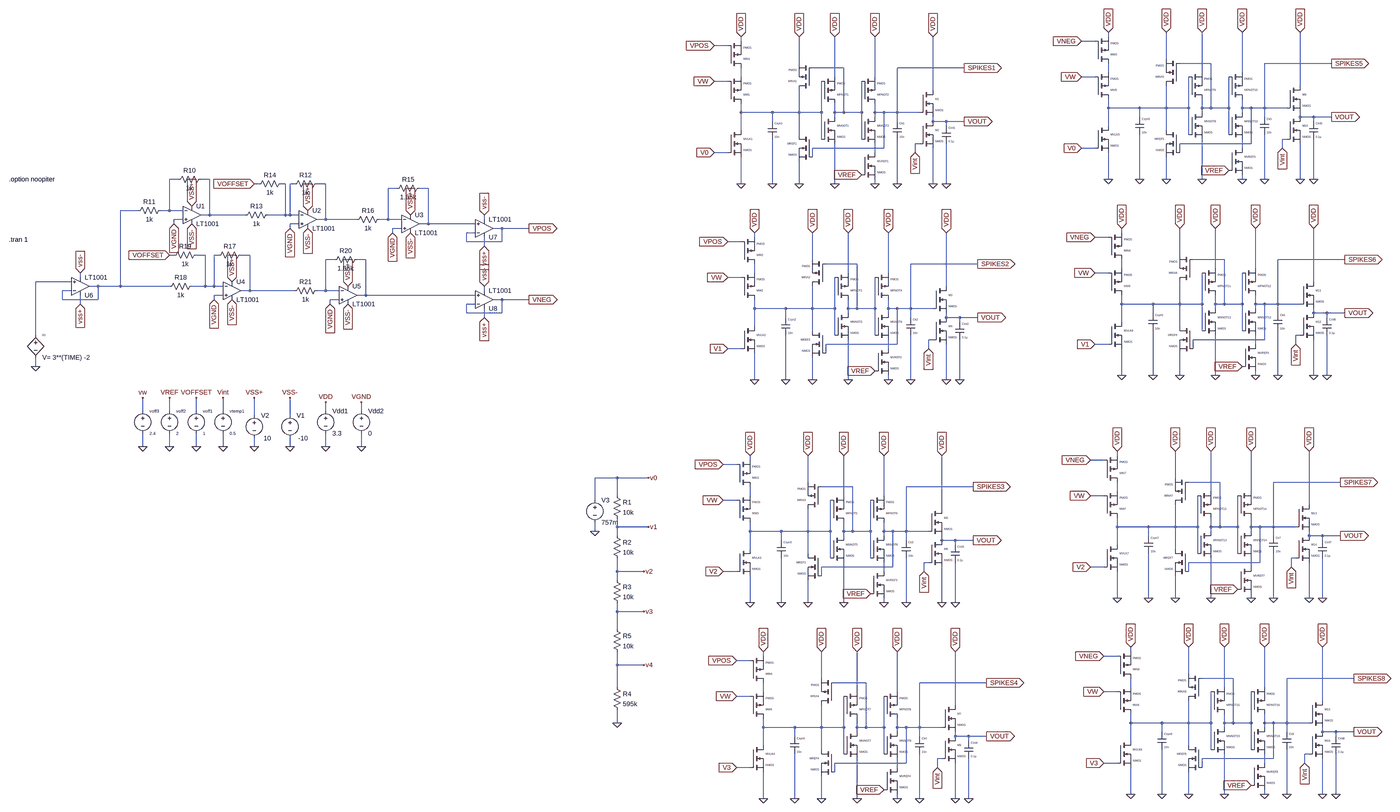
[diagram p0: schematic OZ_8_bounded_curves.asc, whole sheet]
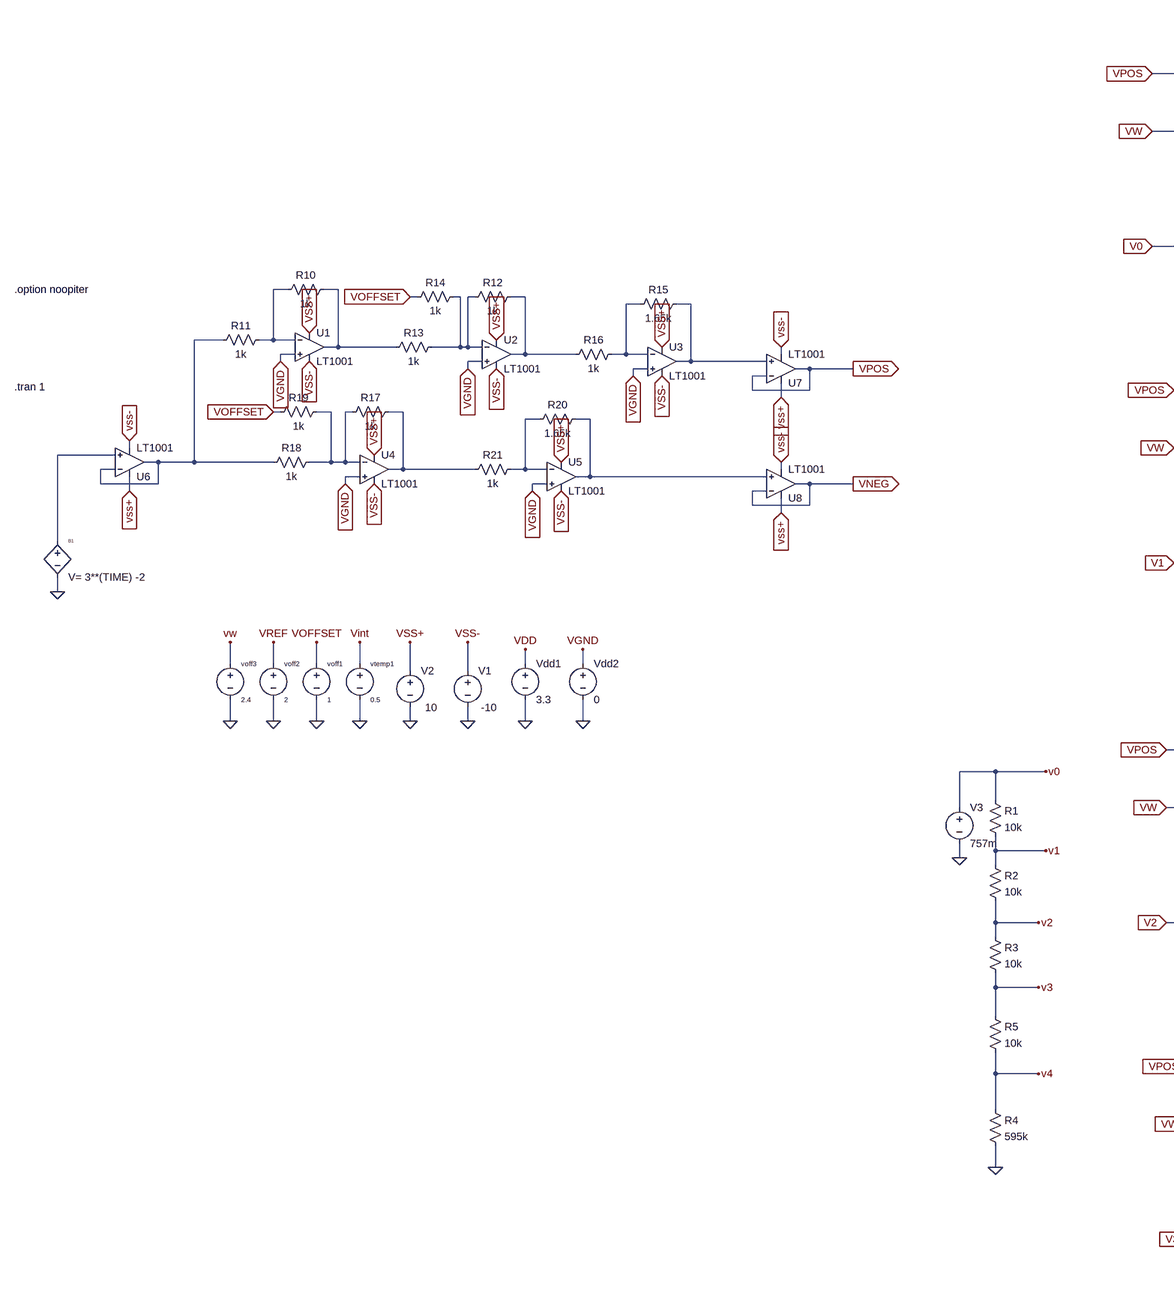
[diagram p1: schematic OZ_8_bounded_curves.asc, part, row 1 of 1, column 1 of 2]
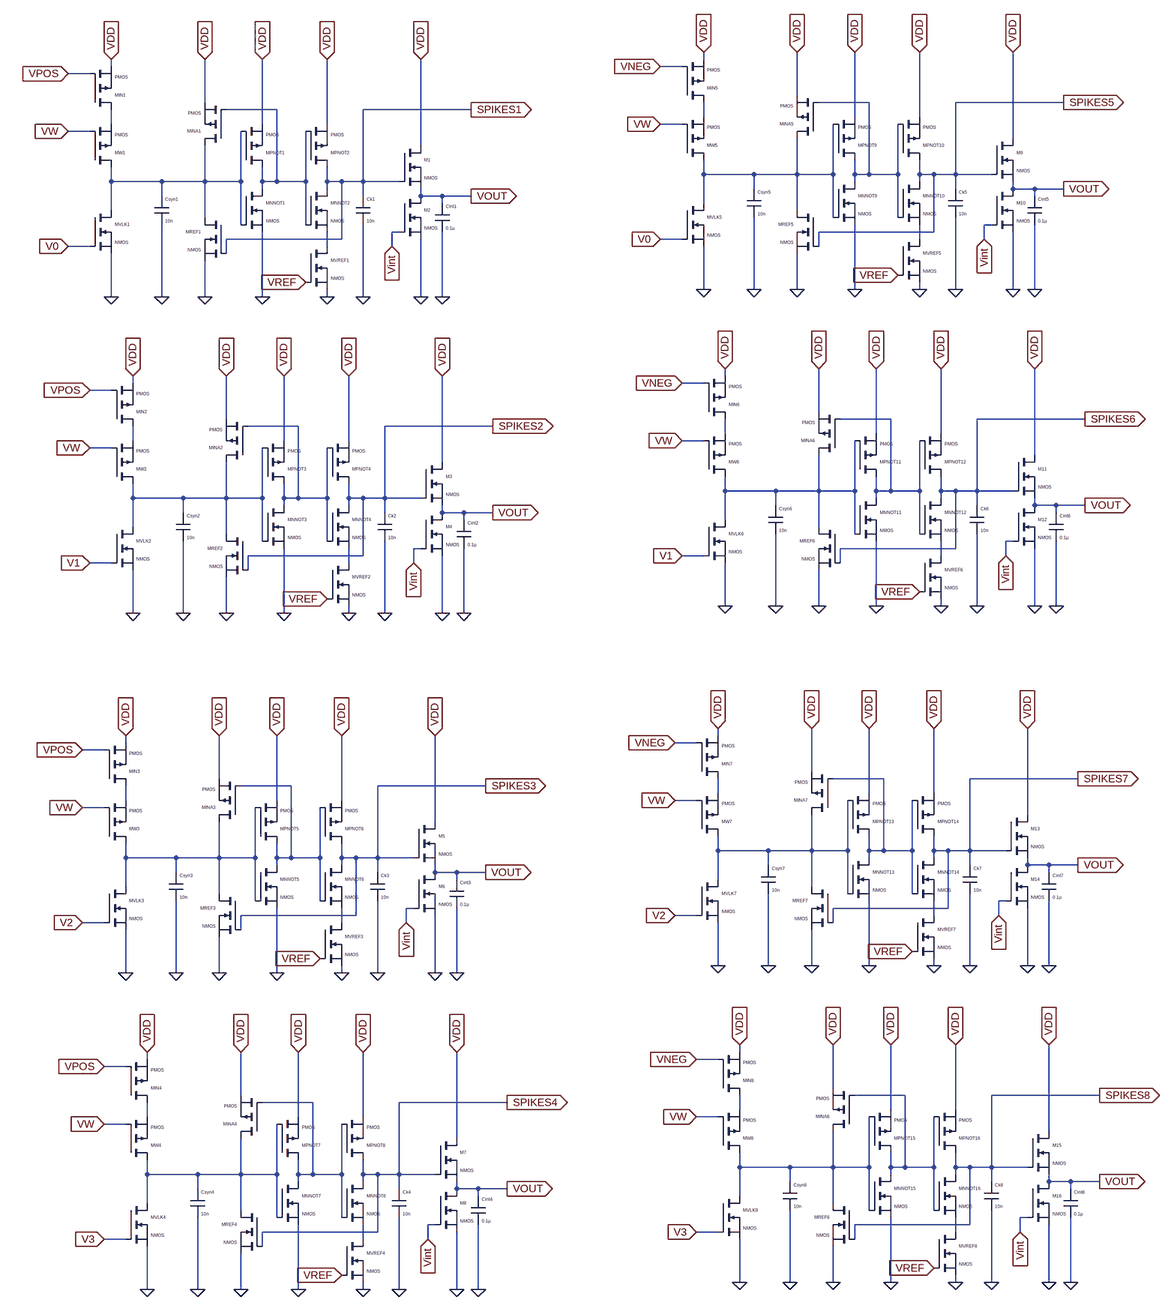
[diagram p2: schematic OZ_8_bounded_curves.asc, part, row 1 of 1, column 2 of 2]
OZ_8_bounded_curves.asc, the LTspice schematic file:
Version 4
SHEET 1 7532 2276
WIRE 5152 -768 5152 -784
WIRE 3760 -752 3760 -768
WIRE 5104 -752 5056 -752
WIRE 3712 -736 3664 -736
WIRE 5360 -688 5360 -784
WIRE 3968 -672 3968 -768
WIRE 5520 -672 5408 -672
WIRE 5952 -672 5712 -672
WIRE 4128 -656 4016 -656
WIRE 4560 -656 4320 -656
WIRE 5152 -640 5152 -672
WIRE 5488 -640 5488 -784
WIRE 5632 -640 5632 -784
WIRE 3760 -624 3760 -656
WIRE 4096 -624 4096 -768
WIRE 4240 -624 4240 -768
WIRE 5104 -624 5056 -624
WIRE 3712 -608 3664 -608
WIRE 5840 -592 5840 -784
WIRE 4448 -576 4448 -768
WIRE 5152 -512 5152 -544
WIRE 5264 -512 5152 -512
WIRE 5360 -512 5360 -592
WIRE 5360 -512 5264 -512
WIRE 5440 -512 5440 -624
WIRE 5440 -512 5360 -512
WIRE 5488 -512 5488 -544
WIRE 5520 -512 5520 -672
WIRE 5520 -512 5488 -512
WIRE 5584 -512 5584 -624
WIRE 5584 -512 5520 -512
WIRE 5632 -512 5632 -544
WIRE 5664 -512 5632 -512
WIRE 5712 -512 5712 -672
WIRE 5712 -512 5664 -512
WIRE 5792 -512 5712 -512
WIRE 3760 -496 3760 -528
WIRE 3872 -496 3760 -496
WIRE 3968 -496 3968 -576
WIRE 3968 -496 3872 -496
WIRE 4048 -496 4048 -608
WIRE 4048 -496 3968 -496
WIRE 4096 -496 4096 -528
WIRE 4128 -496 4128 -656
WIRE 4128 -496 4096 -496
WIRE 4192 -496 4192 -608
WIRE 4192 -496 4128 -496
WIRE 4240 -496 4240 -528
WIRE 4272 -496 4240 -496
WIRE 4320 -496 4320 -656
WIRE 4320 -496 4272 -496
WIRE 4400 -496 4320 -496
WIRE 5488 -496 5488 -512
WIRE 5632 -496 5632 -512
WIRE 4096 -480 4096 -496
WIRE 4240 -480 4240 -496
WIRE 5264 -480 5264 -512
WIRE 5712 -480 5712 -512
WIRE 5840 -480 5840 -496
WIRE 5888 -480 5840 -480
WIRE 5952 -480 5888 -480
WIRE 3872 -464 3872 -496
WIRE 4320 -464 4320 -496
WIRE 4448 -464 4448 -480
WIRE 4496 -464 4448 -464
WIRE 4560 -464 4496 -464
WIRE 5840 -464 5840 -480
WIRE 5888 -464 5888 -480
WIRE 4448 -448 4448 -464
WIRE 4496 -448 4496 -464
WIRE 5152 -448 5152 -512
WIRE 3760 -432 3760 -496
WIRE 5360 -432 5360 -512
WIRE 3968 -416 3968 -496
WIRE 5440 -416 5440 -512
WIRE 5584 -416 5584 -512
WIRE 4048 -400 4048 -496
WIRE 4192 -400 4192 -496
WIRE 5792 -400 5776 -400
WIRE 4400 -384 4384 -384
WIRE 5664 -384 5664 -512
WIRE 5664 -384 5408 -384
WIRE 4272 -368 4272 -496
WIRE 4272 -368 4016 -368
WIRE 5104 -368 5056 -368
WIRE 5632 -368 5632 -400
WIRE 5776 -368 5776 -400
WIRE 3712 -352 3664 -352
WIRE 4240 -352 4240 -384
WIRE 4384 -352 4384 -384
WIRE 5408 -352 5408 -384
WIRE 4016 -336 4016 -368
WIRE 512 -256 480 -256
WIRE 624 -256 592 -256
WIRE 5152 -256 5152 -352
WIRE 5264 -256 5264 -416
WIRE 5360 -256 5360 -336
WIRE 5488 -256 5488 -400
WIRE 5632 -256 5632 -272
WIRE 5712 -256 5712 -416
WIRE 5840 -256 5840 -384
WIRE 5888 -256 5888 -400
WIRE 800 -240 784 -240
WIRE 896 -240 880 -240
WIRE 928 -240 912 -240
WIRE 1040 -240 1008 -240
WIRE 3760 -240 3760 -336
WIRE 3872 -240 3872 -400
WIRE 3968 -240 3968 -320
WIRE 4096 -240 4096 -384
WIRE 4240 -240 4240 -256
WIRE 4320 -240 4320 -400
WIRE 4448 -240 4448 -368
WIRE 4496 -240 4496 -384
WIRE 1296 -224 1264 -224
WIRE 1408 -224 1376 -224
WIRE 368 -144 304 -144
WIRE 480 -144 480 -256
WIRE 480 -144 448 -144
WIRE 528 -144 480 -144
WIRE 624 -128 624 -256
WIRE 624 -128 592 -128
WIRE 752 -128 624 -128
WIRE 896 -128 896 -240
WIRE 896 -128 832 -128
WIRE 912 -128 912 -240
WIRE 912 -128 896 -128
WIRE 944 -128 912 -128
WIRE 528 -112 496 -112
WIRE 1040 -112 1040 -240
WIRE 1040 -112 1008 -112
WIRE 1152 -112 1040 -112
WIRE 1264 -112 1264 -224
WIRE 1264 -112 1232 -112
WIRE 1312 -112 1264 -112
WIRE 1792 -112 1792 -128
WIRE 496 -96 496 -112
WIRE 944 -96 912 -96
WIRE 1408 -96 1408 -224
WIRE 1408 -96 1376 -96
WIRE 1760 -96 1408 -96
WIRE 912 -80 912 -96
WIRE 1312 -80 1280 -80
WIRE 1856 -80 1824 -80
WIRE 1952 -80 1856 -80
WIRE 1280 -64 1280 -80
WIRE 1760 -64 1728 -64
WIRE 5200 -64 5200 -80
WIRE 3808 -48 3808 -64
WIRE 5152 -48 5104 -48
WIRE 1728 -32 1728 -64
WIRE 1856 -32 1856 -80
WIRE 1856 -32 1728 -32
WIRE 3760 -32 3712 -32
WIRE 1792 -16 1792 -48
WIRE 496 16 480 16
WIRE 608 16 576 16
WIRE 656 16 640 16
WIRE 768 16 736 16
WIRE 5408 16 5408 -80
WIRE 1072 32 1040 32
WIRE 1184 32 1152 32
WIRE 4016 32 4016 -64
WIRE 5568 32 5456 32
WIRE 6000 32 5760 32
WIRE 4176 48 4064 48
WIRE 4608 48 4368 48
WIRE 5200 64 5200 32
WIRE 5536 64 5536 -80
WIRE 5680 64 5680 -80
WIRE 3808 80 3808 48
WIRE 4144 80 4144 -64
WIRE 4288 80 4288 -64
WIRE 5152 80 5104 80
WIRE 160 96 160 80
WIRE 3760 96 3712 96
WIRE 128 112 0 112
WIRE 5888 112 5888 -80
WIRE 224 128 192 128
WIRE 304 128 304 -144
WIRE 304 128 224 128
WIRE 480 128 304 128
WIRE 608 128 608 16
WIRE 608 128 560 128
WIRE 640 128 640 16
WIRE 640 128 608 128
WIRE 672 128 640 128
WIRE 4496 128 4496 -64
WIRE 128 144 96 144
WIRE 768 144 768 16
WIRE 768 144 736 144
WIRE 928 144 768 144
WIRE 1040 144 1040 32
WIRE 1040 144 1008 144
WIRE 1088 144 1040 144
WIRE 1792 144 1792 128
WIRE 672 160 640 160
WIRE 1184 160 1184 32
WIRE 1184 160 1152 160
WIRE 1760 160 1184 160
WIRE 96 176 96 144
WIRE 224 176 224 128
WIRE 224 176 96 176
WIRE 640 176 640 160
WIRE 1088 176 1056 176
WIRE 1856 176 1824 176
WIRE 1952 176 1856 176
WIRE 160 192 160 160
WIRE 1056 192 1056 176
WIRE 1760 192 1728 192
WIRE 5200 192 5200 160
WIRE 5312 192 5200 192
WIRE 5408 192 5408 112
WIRE 5408 192 5312 192
WIRE 5488 192 5488 80
WIRE 5488 192 5408 192
WIRE 5536 192 5536 160
WIRE 5568 192 5568 32
WIRE 5568 192 5536 192
WIRE 5632 192 5632 80
WIRE 5632 192 5568 192
WIRE 5680 192 5680 160
WIRE 5712 192 5680 192
WIRE 5760 192 5760 32
WIRE 5760 192 5712 192
WIRE 5840 192 5760 192
WIRE 3808 208 3808 176
WIRE 3920 208 3808 208
WIRE 4016 208 4016 128
WIRE 4016 208 3920 208
WIRE 4096 208 4096 96
WIRE 4096 208 4016 208
WIRE 4144 208 4144 176
WIRE 4176 208 4176 48
WIRE 4176 208 4144 208
WIRE 4240 208 4240 96
WIRE 4240 208 4176 208
WIRE 4288 208 4288 176
WIRE 4320 208 4288 208
WIRE 4368 208 4368 48
WIRE 4368 208 4320 208
WIRE 4448 208 4368 208
WIRE 5536 208 5536 192
WIRE 5680 208 5680 192
WIRE 1728 224 1728 192
WIRE 1856 224 1856 176
WIRE 1856 224 1728 224
WIRE 4144 224 4144 208
WIRE 4288 224 4288 208
WIRE 5312 224 5312 192
WIRE 5760 224 5760 192
WIRE 5888 224 5888 208
WIRE 5936 224 5888 224
WIRE 6000 224 5936 224
WIRE 1792 240 1792 208
WIRE 3920 240 3920 208
WIRE 4368 240 4368 208
WIRE 4496 240 4496 224
WIRE 4544 240 4496 240
WIRE 4608 240 4544 240
WIRE 5888 240 5888 224
WIRE 5936 240 5936 224
WIRE 4496 256 4496 240
WIRE 4544 256 4544 240
WIRE 5200 256 5200 192
WIRE 3808 272 3808 208
WIRE 5408 272 5408 192
WIRE 4016 288 4016 208
WIRE 5488 288 5488 192
WIRE 5632 288 5632 192
WIRE 0 304 0 112
WIRE 4096 304 4096 208
WIRE 4240 304 4240 208
WIRE 5840 304 5824 304
WIRE 4448 320 4432 320
WIRE 5712 320 5712 192
WIRE 5712 320 5456 320
WIRE 4320 336 4320 208
WIRE 4320 336 4064 336
WIRE 5152 336 5104 336
WIRE 5680 336 5680 304
WIRE 5824 336 5824 304
WIRE 3760 352 3712 352
WIRE 4288 352 4288 320
WIRE 4432 352 4432 320
WIRE 5456 352 5456 320
WIRE 4064 368 4064 336
WIRE 0 416 0 384
WIRE 5200 448 5200 352
WIRE 5312 448 5312 288
WIRE 5408 448 5408 368
WIRE 5536 448 5536 304
WIRE 5680 448 5680 432
WIRE 5760 448 5760 288
WIRE 5888 448 5888 320
WIRE 5936 448 5936 304
WIRE 3808 464 3808 368
WIRE 3920 464 3920 304
WIRE 4016 464 4016 384
WIRE 4144 464 4144 320
WIRE 4288 464 4288 448
WIRE 4368 464 4368 304
WIRE 4496 464 4496 336
WIRE 4544 464 4544 320
WIRE 384 576 384 528
WIRE 480 576 480 528
WIRE 576 576 576 528
WIRE 672 576 672 528
WIRE 1040 576 1040 544
WIRE 1168 576 1168 544
WIRE 784 592 784 528
WIRE 912 592 912 528
WIRE 384 704 384 656
WIRE 480 704 480 656
WIRE 576 704 576 656
WIRE 672 704 672 656
WIRE 784 704 784 672
WIRE 912 704 912 672
WIRE 1040 704 1040 656
WIRE 1168 704 1168 656
WIRE 5184 736 5184 720
WIRE 3792 752 3792 736
WIRE 5136 752 5088 752
WIRE 3744 768 3696 768
WIRE 2432 816 2352 816
WIRE 2544 816 2432 816
WIRE 5392 816 5392 720
WIRE 4000 832 4000 736
WIRE 5552 832 5440 832
WIRE 5984 832 5744 832
WIRE 4160 848 4048 848
WIRE 4592 848 4352 848
WIRE 5184 864 5184 832
WIRE 5520 864 5520 720
WIRE 5664 864 5664 720
WIRE 2432 880 2432 816
WIRE 3792 880 3792 848
WIRE 4128 880 4128 736
WIRE 4272 880 4272 736
WIRE 5136 880 5088 880
WIRE 2352 896 2352 816
WIRE 3744 896 3696 896
WIRE 5872 912 5872 720
WIRE 4480 928 4480 736
WIRE 2432 992 2432 960
WIRE 2544 992 2432 992
WIRE 5184 992 5184 960
WIRE 5296 992 5184 992
WIRE 5392 992 5392 912
WIRE 5392 992 5296 992
WIRE 5472 992 5472 880
WIRE 5472 992 5392 992
WIRE 5520 992 5520 960
WIRE 5552 992 5552 832
WIRE 5552 992 5520 992
WIRE 5616 992 5616 880
WIRE 5616 992 5552 992
WIRE 5664 992 5664 960
WIRE 5696 992 5664 992
WIRE 5744 992 5744 832
WIRE 5744 992 5696 992
WIRE 5824 992 5744 992
WIRE 2352 1008 2352 976
WIRE 3792 1008 3792 976
WIRE 3904 1008 3792 1008
WIRE 4000 1008 4000 928
WIRE 4000 1008 3904 1008
WIRE 4080 1008 4080 896
WIRE 4080 1008 4000 1008
WIRE 4128 1008 4128 976
WIRE 4160 1008 4160 848
WIRE 4160 1008 4128 1008
WIRE 4224 1008 4224 896
WIRE 4224 1008 4160 1008
WIRE 4272 1008 4272 976
WIRE 4304 1008 4272 1008
WIRE 4352 1008 4352 848
WIRE 4352 1008 4304 1008
WIRE 4432 1008 4352 1008
WIRE 5520 1008 5520 992
WIRE 5664 1008 5664 992
WIRE 2432 1024 2432 992
WIRE 4128 1024 4128 1008
WIRE 4272 1024 4272 1008
WIRE 5296 1024 5296 992
WIRE 5744 1024 5744 992
WIRE 5872 1024 5872 1008
WIRE 5920 1024 5872 1024
WIRE 5984 1024 5920 1024
WIRE 3904 1040 3904 1008
WIRE 4352 1040 4352 1008
WIRE 4480 1040 4480 1024
WIRE 4528 1040 4480 1040
WIRE 4592 1040 4528 1040
WIRE 5872 1040 5872 1024
WIRE 5920 1040 5920 1024
WIRE 4480 1056 4480 1040
WIRE 4528 1056 4528 1040
WIRE 5184 1056 5184 992
WIRE 3792 1072 3792 1008
WIRE 5392 1072 5392 992
WIRE 4000 1088 4000 1008
WIRE 5472 1088 5472 992
WIRE 5616 1088 5616 992
WIRE 4080 1104 4080 1008
WIRE 4224 1104 4224 1008
WIRE 5824 1104 5808 1104
WIRE 4432 1120 4416 1120
WIRE 5696 1120 5696 992
WIRE 5696 1120 5440 1120
WIRE 4304 1136 4304 1008
WIRE 4304 1136 4048 1136
WIRE 5136 1136 5088 1136
WIRE 5664 1136 5664 1104
WIRE 5808 1136 5808 1104
WIRE 2432 1152 2432 1104
WIRE 2528 1152 2432 1152
WIRE 3744 1152 3696 1152
WIRE 4272 1152 4272 1120
WIRE 4416 1152 4416 1120
WIRE 5440 1152 5440 1120
WIRE 4048 1168 4048 1136
WIRE 2432 1184 2432 1152
WIRE 5184 1248 5184 1152
WIRE 5296 1248 5296 1088
WIRE 5392 1248 5392 1168
WIRE 5520 1248 5520 1104
WIRE 5664 1248 5664 1232
WIRE 5744 1248 5744 1088
WIRE 5872 1248 5872 1120
WIRE 5920 1248 5920 1104
WIRE 3792 1264 3792 1168
WIRE 3904 1264 3904 1104
WIRE 4000 1264 4000 1184
WIRE 4128 1264 4128 1120
WIRE 4272 1264 4272 1248
WIRE 4352 1264 4352 1104
WIRE 4480 1264 4480 1136
WIRE 4528 1264 4528 1120
WIRE 2432 1296 2432 1264
WIRE 2528 1296 2432 1296
WIRE 2432 1360 2432 1296
WIRE 5232 1440 5232 1424
WIRE 3840 1456 3840 1440
WIRE 5184 1456 5136 1456
WIRE 3792 1472 3744 1472
WIRE 2432 1488 2432 1440
WIRE 2528 1488 2432 1488
WIRE 5440 1520 5440 1424
WIRE 4048 1536 4048 1440
WIRE 5600 1536 5488 1536
WIRE 6032 1536 5792 1536
WIRE 4208 1552 4096 1552
WIRE 4640 1552 4400 1552
WIRE 2432 1568 2432 1488
WIRE 5232 1568 5232 1536
WIRE 5568 1568 5568 1424
WIRE 5712 1568 5712 1424
WIRE 3840 1584 3840 1552
WIRE 4176 1584 4176 1440
WIRE 4320 1584 4320 1440
WIRE 5184 1584 5136 1584
WIRE 3792 1600 3744 1600
WIRE 5920 1616 5920 1424
WIRE 4528 1632 4528 1440
WIRE 2432 1696 2432 1648
WIRE 5232 1696 5232 1664
WIRE 5344 1696 5232 1696
WIRE 5440 1696 5440 1616
WIRE 5440 1696 5344 1696
WIRE 5520 1696 5520 1584
WIRE 5520 1696 5440 1696
WIRE 5568 1696 5568 1664
WIRE 5600 1696 5600 1536
WIRE 5600 1696 5568 1696
WIRE 5664 1696 5664 1584
WIRE 5664 1696 5600 1696
WIRE 5712 1696 5712 1664
WIRE 5744 1696 5712 1696
WIRE 5792 1696 5792 1536
WIRE 5792 1696 5744 1696
WIRE 5872 1696 5792 1696
WIRE 3840 1712 3840 1680
WIRE 3952 1712 3840 1712
WIRE 4048 1712 4048 1632
WIRE 4048 1712 3952 1712
WIRE 4128 1712 4128 1600
WIRE 4128 1712 4048 1712
WIRE 4176 1712 4176 1680
WIRE 4208 1712 4208 1552
WIRE 4208 1712 4176 1712
WIRE 4272 1712 4272 1600
WIRE 4272 1712 4208 1712
WIRE 4320 1712 4320 1680
WIRE 4352 1712 4320 1712
WIRE 4400 1712 4400 1552
WIRE 4400 1712 4352 1712
WIRE 4480 1712 4400 1712
WIRE 5568 1712 5568 1696
WIRE 5712 1712 5712 1696
WIRE 4176 1728 4176 1712
WIRE 4320 1728 4320 1712
WIRE 5344 1728 5344 1696
WIRE 5792 1728 5792 1696
WIRE 5920 1728 5920 1712
WIRE 5968 1728 5920 1728
WIRE 6032 1728 5968 1728
WIRE 3952 1744 3952 1712
WIRE 4400 1744 4400 1712
WIRE 4528 1744 4528 1728
WIRE 4576 1744 4528 1744
WIRE 4640 1744 4576 1744
WIRE 5920 1744 5920 1728
WIRE 5968 1744 5968 1728
WIRE 4528 1760 4528 1744
WIRE 4576 1760 4576 1744
WIRE 5232 1760 5232 1696
WIRE 3840 1776 3840 1712
WIRE 5440 1776 5440 1696
WIRE 4048 1792 4048 1712
WIRE 5520 1792 5520 1696
WIRE 5664 1792 5664 1696
WIRE 4128 1808 4128 1712
WIRE 4272 1808 4272 1712
WIRE 5872 1808 5856 1808
WIRE 4480 1824 4464 1824
WIRE 5744 1824 5744 1696
WIRE 5744 1824 5488 1824
WIRE 4352 1840 4352 1712
WIRE 4352 1840 4096 1840
WIRE 5184 1840 5136 1840
WIRE 5712 1840 5712 1808
WIRE 5856 1840 5856 1808
WIRE 3792 1856 3744 1856
WIRE 4320 1856 4320 1824
WIRE 4464 1856 4464 1824
WIRE 5488 1856 5488 1824
WIRE 4096 1872 4096 1840
WIRE 5232 1952 5232 1856
WIRE 5344 1952 5344 1792
WIRE 5440 1952 5440 1872
WIRE 5568 1952 5568 1808
WIRE 5712 1952 5712 1936
WIRE 5792 1952 5792 1792
WIRE 5920 1952 5920 1824
WIRE 5968 1952 5968 1808
WIRE 3840 1968 3840 1872
WIRE 3952 1968 3952 1808
WIRE 4048 1968 4048 1888
WIRE 4176 1968 4176 1824
WIRE 4320 1968 4320 1952
WIRE 4400 1968 4400 1808
WIRE 4528 1968 4528 1840
WIRE 4576 1968 4576 1824
FLAG 672 704 0
FLAG 672 528 Vint
FLAG 1040 544 VDD
FLAG 1040 704 0
FLAG 912 704 0
FLAG 912 528 VSS-
FLAG 784 704 0
FLAG 784 528 VSS+
FLAG 576 704 0
FLAG 576 528 VOFFSET
FLAG 480 704 0
FLAG 480 528 VREF
FLAG 384 704 0
FLAG 384 528 vw
FLAG 1168 544 VGND
FLAG 1168 704 0
FLAG 0 416 0
FLAG 1952 -80 VPOS
IOPIN 1952 -80 Out
FLAG 1952 176 VNEG
IOPIN 1952 176 Out
FLAG 1056 192 VGND
IOPIN 1056 192 In
FLAG 640 176 VGND
IOPIN 640 176 In
FLAG 496 -96 VGND
IOPIN 496 -96 In
FLAG 912 -80 VGND
IOPIN 912 -80 In
FLAG 1280 -64 VGND
IOPIN 1280 -64 In
FLAG 1344 -128 VSS+
IOPIN 1344 -128 In
FLAG 976 -144 VSS+
IOPIN 976 -144 In
FLAG 560 -160 VSS+
IOPIN 560 -160 In
FLAG 704 112 VSS+
IOPIN 704 112 In
FLAG 1120 128 VSS+
IOPIN 1120 128 In
FLAG 1344 -64 VSS-
IOPIN 1344 -64 In
FLAG 976 -80 VSS-
IOPIN 976 -80 In
FLAG 560 -96 VSS-
IOPIN 560 -96 In
FLAG 704 176 VSS-
IOPIN 704 176 In
FLAG 1120 192 VSS-
IOPIN 1120 192 In
FLAG 784 -240 VOFFSET
IOPIN 784 -240 In
FLAG 480 16 VOFFSET
IOPIN 480 16 In
FLAG 160 192 vss+
IOPIN 160 192 In
FLAG 160 80 vss-
IOPIN 160 80 In
FLAG 1792 -16 vss+
IOPIN 1792 -16 In
FLAG 1792 -128 vss-
IOPIN 1792 -128 In
FLAG 1792 240 vss+
IOPIN 1792 240 In
FLAG 1792 128 vss-
IOPIN 1792 128 In
FLAG 4096 -768 VDD
IOPIN 4096 -768 In
FLAG 3664 -736 VPOS
IOPIN 3664 -736 In
FLAG 3664 -608 VW
IOPIN 3664 -608 In
FLAG 3664 -352 V0
IOPIN 3664 -352 In
FLAG 4192 -272 VREF
IOPIN 4192 -272 In
FLAG 4384 -352 Vint
IOPIN 4384 -352 In
FLAG 4560 -464 VOUT
IOPIN 4560 -464 Out
FLAG 3760 -240 0
FLAG 3872 -240 0
FLAG 3968 -240 0
FLAG 4096 -240 0
FLAG 4240 -240 0
FLAG 4320 -240 0
FLAG 4448 -240 0
FLAG 4496 -240 0
FLAG 3968 -768 VDD
IOPIN 3968 -768 In
FLAG 3760 -768 VDD
IOPIN 3760 -768 In
FLAG 4448 -768 VDD
IOPIN 4448 -768 In
FLAG 4240 -768 VDD
IOPIN 4240 -768 In
FLAG 4560 -656 SPIKES1
IOPIN 4560 -656 Out
FLAG 4144 -64 VDD
IOPIN 4144 -64 In
FLAG 3712 -32 VPOS
IOPIN 3712 -32 In
FLAG 3712 96 VW
IOPIN 3712 96 In
FLAG 3712 352 V1
IOPIN 3712 352 In
FLAG 4240 432 VREF
IOPIN 4240 432 In
FLAG 4432 352 Vint
IOPIN 4432 352 In
FLAG 4608 240 VOUT
IOPIN 4608 240 Out
FLAG 3808 464 0
FLAG 3920 464 0
FLAG 4016 464 0
FLAG 4144 464 0
FLAG 4288 464 0
FLAG 4368 464 0
FLAG 4496 464 0
FLAG 4544 464 0
FLAG 4016 -64 VDD
IOPIN 4016 -64 In
FLAG 3808 -64 VDD
IOPIN 3808 -64 In
FLAG 4496 -64 VDD
IOPIN 4496 -64 In
FLAG 4288 -64 VDD
IOPIN 4288 -64 In
FLAG 4608 48 SPIKES2
IOPIN 4608 48 Out
FLAG 4128 736 VDD
IOPIN 4128 736 In
FLAG 3696 768 VPOS
IOPIN 3696 768 In
FLAG 3696 896 VW
IOPIN 3696 896 In
FLAG 3696 1152 V2
IOPIN 3696 1152 In
FLAG 4224 1232 VREF
IOPIN 4224 1232 In
FLAG 4416 1152 Vint
IOPIN 4416 1152 In
FLAG 4592 1040 VOUT
IOPIN 4592 1040 Out
FLAG 3792 1264 0
FLAG 3904 1264 0
FLAG 4000 1264 0
FLAG 4128 1264 0
FLAG 4272 1264 0
FLAG 4352 1264 0
FLAG 4480 1264 0
FLAG 4528 1264 0
FLAG 4000 736 VDD
IOPIN 4000 736 In
FLAG 3792 736 VDD
IOPIN 3792 736 In
FLAG 4480 736 VDD
IOPIN 4480 736 In
FLAG 4272 736 VDD
IOPIN 4272 736 In
FLAG 4592 848 SPIKES3
IOPIN 4592 848 Out
FLAG 4176 1440 VDD
IOPIN 4176 1440 In
FLAG 3744 1472 VPOS
IOPIN 3744 1472 In
FLAG 3744 1600 VW
IOPIN 3744 1600 In
FLAG 3744 1856 V3
IOPIN 3744 1856 In
FLAG 4272 1936 VREF
IOPIN 4272 1936 In
FLAG 4464 1856 Vint
IOPIN 4464 1856 In
FLAG 4640 1744 VOUT
IOPIN 4640 1744 Out
FLAG 3840 1968 0
FLAG 3952 1968 0
FLAG 4048 1968 0
FLAG 4176 1968 0
FLAG 4320 1968 0
FLAG 4400 1968 0
FLAG 4528 1968 0
FLAG 4576 1968 0
FLAG 4048 1440 VDD
IOPIN 4048 1440 In
FLAG 3840 1440 VDD
IOPIN 3840 1440 In
FLAG 4528 1440 VDD
IOPIN 4528 1440 In
FLAG 4320 1440 VDD
IOPIN 4320 1440 In
FLAG 4640 1552 SPIKES4
IOPIN 4640 1552 Out
FLAG 5488 -784 VDD
IOPIN 5488 -784 In
FLAG 5056 -752 VNEG
IOPIN 5056 -752 In
FLAG 5056 -624 VW
IOPIN 5056 -624 In
FLAG 5056 -368 V0
IOPIN 5056 -368 In
FLAG 5584 -288 VREF
IOPIN 5584 -288 In
FLAG 5776 -368 Vint
IOPIN 5776 -368 In
FLAG 5952 -480 VOUT
IOPIN 5952 -480 Out
FLAG 5152 -256 0
FLAG 5264 -256 0
FLAG 5360 -256 0
FLAG 5488 -256 0
FLAG 5632 -256 0
FLAG 5712 -256 0
FLAG 5840 -256 0
FLAG 5888 -256 0
FLAG 5360 -784 VDD
IOPIN 5360 -784 In
FLAG 5152 -784 VDD
IOPIN 5152 -784 In
FLAG 5840 -784 VDD
IOPIN 5840 -784 In
FLAG 5632 -784 VDD
IOPIN 5632 -784 In
FLAG 5952 -672 SPIKES5
IOPIN 5952 -672 Out
FLAG 5536 -80 VDD
IOPIN 5536 -80 In
FLAG 5104 -48 VNEG
IOPIN 5104 -48 In
FLAG 5104 80 VW
IOPIN 5104 80 In
FLAG 5104 336 V1
IOPIN 5104 336 In
FLAG 5632 416 VREF
IOPIN 5632 416 In
FLAG 5824 336 Vint
IOPIN 5824 336 In
FLAG 6000 224 VOUT
IOPIN 6000 224 Out
FLAG 5200 448 0
FLAG 5312 448 0
FLAG 5408 448 0
FLAG 5536 448 0
FLAG 5680 448 0
FLAG 5760 448 0
FLAG 5888 448 0
FLAG 5936 448 0
FLAG 5408 -80 VDD
IOPIN 5408 -80 In
FLAG 5200 -80 VDD
IOPIN 5200 -80 In
FLAG 5888 -80 VDD
IOPIN 5888 -80 In
FLAG 5680 -80 VDD
IOPIN 5680 -80 In
FLAG 6000 32 SPIKES6
IOPIN 6000 32 Out
FLAG 5520 720 VDD
IOPIN 5520 720 In
FLAG 5088 752 VNEG
IOPIN 5088 752 In
FLAG 5088 880 VW
IOPIN 5088 880 In
FLAG 5088 1136 V2
IOPIN 5088 1136 In
FLAG 5616 1216 VREF
IOPIN 5616 1216 In
FLAG 5808 1136 Vint
IOPIN 5808 1136 In
FLAG 5984 1024 VOUT
IOPIN 5984 1024 Out
FLAG 5184 1248 0
FLAG 5296 1248 0
FLAG 5392 1248 0
FLAG 5520 1248 0
FLAG 5664 1248 0
FLAG 5744 1248 0
FLAG 5872 1248 0
FLAG 5920 1248 0
FLAG 5392 720 VDD
IOPIN 5392 720 In
FLAG 5184 720 VDD
IOPIN 5184 720 In
FLAG 5872 720 VDD
IOPIN 5872 720 In
FLAG 5664 720 VDD
IOPIN 5664 720 In
FLAG 5984 832 SPIKES7
IOPIN 5984 832 Out
FLAG 5568 1424 VDD
IOPIN 5568 1424 In
FLAG 5136 1456 VNEG
IOPIN 5136 1456 In
FLAG 5136 1584 VW
IOPIN 5136 1584 In
FLAG 5136 1840 V3
IOPIN 5136 1840 In
FLAG 5664 1920 VREF
IOPIN 5664 1920 In
FLAG 5856 1840 Vint
IOPIN 5856 1840 In
FLAG 6032 1728 VOUT
IOPIN 6032 1728 Out
FLAG 5232 1952 0
FLAG 5344 1952 0
FLAG 5440 1952 0
FLAG 5568 1952 0
FLAG 5712 1952 0
FLAG 5792 1952 0
FLAG 5920 1952 0
FLAG 5968 1952 0
FLAG 5440 1424 VDD
IOPIN 5440 1424 In
FLAG 5232 1424 VDD
IOPIN 5232 1424 In
FLAG 5920 1424 VDD
IOPIN 5920 1424 In
FLAG 5712 1424 VDD
IOPIN 5712 1424 In
FLAG 6032 1536 SPIKES8
IOPIN 6032 1536 Out
FLAG 2352 1008 0
FLAG 2544 992 v1
FLAG 2528 1152 v2
FLAG 2528 1296 v3
FLAG 2528 1488 v4
FLAG 2432 1696 0
FLAG 2544 816 v0
SYMBOL voltage 672 560 R0
WINDOW 123 0 0 Left 0
WINDOW 39 0 0 Left 0
WINDOW 0 24 16 Left 1
WINDOW 3 24 96 Left 1
SYMATTR InstName vtemp1
SYMATTR Value 0.5
SYMBOL voltage 1040 560 R0
WINDOW 123 0 0 Left 0
WINDOW 39 0 0 Left 0
SYMATTR InstName Vdd1
SYMATTR Value 3.3
SYMBOL voltage 912 576 R0
WINDOW 3 47 82 Top 2
WINDOW 123 0 0 Left 0
WINDOW 39 0 0 Left 0
SYMATTR Value -10
SYMATTR InstName V1
SYMBOL voltage 784 576 R0
WINDOW 3 47 82 Top 2
WINDOW 123 0 0 Left 0
WINDOW 39 0 0 Left 0
SYMATTR Value 10
SYMATTR InstName V2
SYMBOL voltage 576 560 R0
WINDOW 123 0 0 Left 0
WINDOW 39 0 0 Left 0
WINDOW 0 24 16 Left 1
WINDOW 3 24 96 Left 1
SYMATTR InstName voff1
SYMATTR Value 1
SYMBOL voltage 480 560 R0
WINDOW 123 0 0 Left 0
WINDOW 39 0 0 Left 0
WINDOW 0 24 16 Left 1
WINDOW 3 24 96 Left 1
SYMATTR InstName voff2
SYMATTR Value 2
SYMBOL voltage 384 560 R0
WINDOW 123 0 0 Left 0
WINDOW 39 0 0 Left 0
WINDOW 0 24 16 Left 1
WINDOW 3 24 96 Left 1
SYMATTR InstName voff3
SYMATTR Value 2.4
SYMBOL voltage 1168 560 R0
WINDOW 123 0 0 Left 0
WINDOW 39 0 0 Left 0
SYMATTR InstName Vdd2
SYMATTR Value 0
SYMBOL OpAmps\\LT1001 560 -192 R0
SYMATTR InstName U1
SYMBOL res 608 -272 R90
WINDOW 0 0 56 VBottom 2
WINDOW 3 32 56 VTop 2
SYMATTR InstName R10
SYMATTR Value 1k
SYMBOL res 464 -160 R90
WINDOW 0 0 56 VBottom 2
WINDOW 3 32 56 VTop 2
SYMATTR InstName R11
SYMATTR Value 1k
SYMBOL OpAmps\\LT1001 976 -176 R0
SYMATTR InstName U2
SYMBOL res 1024 -256 R90
WINDOW 0 0 56 VBottom 2
WINDOW 3 32 56 VTop 2
SYMATTR InstName R12
SYMATTR Value 1k
SYMBOL res 848 -144 R90
WINDOW 0 0 56 VBottom 2
WINDOW 3 32 56 VTop 2
SYMATTR InstName R13
SYMATTR Value 1k
SYMBOL res 896 -256 R90
WINDOW 0 0 56 VBottom 2
WINDOW 3 32 56 VTop 2
SYMATTR InstName R14
SYMATTR Value 1k
SYMBOL OpAmps\\LT1001 1344 -160 R0
SYMATTR InstName U3
SYMBOL res 1392 -240 R90
WINDOW 0 0 56 VBottom 2
WINDOW 3 32 56 VTop 2
SYMATTR InstName R15
SYMATTR Value 1.65k
SYMBOL res 1248 -128 R90
WINDOW 0 0 56 VBottom 2
WINDOW 3 32 56 VTop 2
SYMATTR InstName R16
SYMATTR Value 1k
SYMBOL OpAmps\\LT1001 704 80 R0
SYMATTR InstName U4
SYMBOL res 752 0 R90
WINDOW 0 0 56 VBottom 2
WINDOW 3 32 56 VTop 2
SYMATTR InstName R17
SYMATTR Value 1k
SYMBOL res 576 112 R90
WINDOW 0 0 56 VBottom 2
WINDOW 3 32 56 VTop 2
SYMATTR InstName R18
SYMATTR Value 1k
SYMBOL res 592 0 R90
WINDOW 0 0 56 VBottom 2
WINDOW 3 32 56 VTop 2
SYMATTR InstName R19
SYMATTR Value 1k
SYMBOL OpAmps\\LT1001 1120 96 R0
SYMATTR InstName U5
SYMBOL res 1168 16 R90
WINDOW 0 0 56 VBottom 2
WINDOW 3 32 56 VTop 2
SYMATTR InstName R20
SYMATTR Value 1.65k
SYMBOL res 1024 128 R90
WINDOW 0 0 56 VBottom 2
WINDOW 3 32 56 VTop 2
SYMATTR InstName R21
SYMATTR Value 1k
SYMBOL OpAmps\\LT1001 160 192 M180
SYMATTR InstName U6
SYMBOL OpAmps\\LT1001 1792 -16 M180
SYMATTR InstName U7
SYMBOL OpAmps\\LT1001 1792 240 M180
SYMATTR InstName U8
SYMBOL pmos 3712 -528 M180
WINDOW 0 56 32 Left 0
WINDOW 3 56 72 Left 0
SYMATTR InstName MW1
SYMBOL cap 3856 -464 R0
WINDOW 0 24 8 Left 0
WINDOW 3 24 56 Left 0
SYMATTR InstName Csyn1
SYMATTR Value 10n
SYMATTR SpiceLine V=4 Irms=162m Rser=0.395426 Lser=0 mfg="KEMET" pn="C0402C103K7PAC" type="X5R" IC=0
SYMBOL cap 4304 -464 R0
WINDOW 0 24 8 Left 0
WINDOW 3 24 56 Left 0
SYMATTR InstName Ck1
SYMATTR Value 10n
SYMBOL pmos 4048 -528 M180
WINDOW 0 56 32 Left 0
WINDOW 3 56 72 Left 0
SYMATTR InstName MPNOT1
SYMBOL nmos 4048 -480 R0
WINDOW 0 56 32 Left 0
WINDOW 3 56 72 Left 0
SYMATTR InstName MNNOT1
SYMBOL nmos 4192 -352 R0
WINDOW 0 56 32 Left 0
WINDOW 3 56 72 Left 0
SYMATTR InstName MVREF1
SYMBOL nmos 4016 -416 M0
WINDOW 0 56 32 Left 0
WINDOW 3 56 72 Left 0
SYMATTR InstName MREF1
SYMBOL nmos 3712 -432 R0
WINDOW 0 56 32 Left 0
WINDOW 3 56 72 Left 0
SYMATTR InstName MVLK1
SYMBOL pmos 4016 -576 R180
WINDOW 0 56 32 Left 0
WINDOW 3 56 72 Left 0
SYMATTR InstName MINA1
SYMBOL pmos 3712 -656 M180
WINDOW 0 56 32 Left 0
WINDOW 3 56 72 Left 0
SYMATTR InstName MIN1
SYMBOL pmos 4192 -528 M180
WINDOW 0 56 32 Left 0
WINDOW 3 56 72 Left 0
SYMATTR InstName MPNOT2
SYMBOL nmos 4192 -480 R0
WINDOW 0 56 32 Left 0
WINDOW 3 56 72 Left 0
SYMATTR InstName MNNOT2
SYMBOL nmos 4400 -576 R0
WINDOW 0 56 32 Left 0
WINDOW 3 56 72 Left 0
SYMATTR InstName M1
SYMBOL nmos 4400 -464 R0
WINDOW 0 56 32 Left 0
WINDOW 3 56 72 Left 0
SYMATTR InstName M2
SYMBOL cap 4480 -448 R0
WINDOW 0 24 8 Left 0
WINDOW 3 24 56 Left 0
SYMATTR InstName Cint1
SYMATTR Value 0.1µ
SYMBOL pmos 3760 176 M180
WINDOW 0 56 32 Left 0
WINDOW 3 56 72 Left 0
SYMATTR InstName MW2
SYMBOL cap 3904 240 R0
WINDOW 0 24 8 Left 0
WINDOW 3 24 56 Left 0
SYMATTR InstName Csyn2
SYMATTR Value 10n
SYMATTR SpiceLine V=4 Irms=162m Rser=0.395426 Lser=0 mfg="KEMET" pn="C0402C103K7PAC" type="X5R" IC=0
SYMBOL cap 4352 240 R0
WINDOW 0 24 8 Left 0
WINDOW 3 24 56 Left 0
SYMATTR InstName Ck2
SYMATTR Value 10n
SYMBOL pmos 4096 176 M180
WINDOW 0 56 32 Left 0
WINDOW 3 56 72 Left 0
SYMATTR InstName MPNOT3
SYMBOL nmos 4096 224 R0
WINDOW 0 56 32 Left 0
WINDOW 3 56 72 Left 0
SYMATTR InstName MNNOT3
SYMBOL nmos 4240 352 R0
WINDOW 0 56 32 Left 0
WINDOW 3 56 72 Left 0
SYMATTR InstName MVREF2
SYMBOL nmos 4064 288 M0
WINDOW 0 56 32 Left 0
WINDOW 3 56 72 Left 0
SYMATTR InstName MREF2
SYMBOL nmos 3760 272 R0
WINDOW 0 56 32 Left 0
WINDOW 3 56 72 Left 0
SYMATTR InstName MVLK2
SYMBOL pmos 4064 128 R180
WINDOW 0 56 32 Left 0
WINDOW 3 56 72 Left 0
SYMATTR InstName MINA2
SYMBOL pmos 3760 48 M180
WINDOW 0 56 32 Left 0
WINDOW 3 56 72 Left 0
SYMATTR InstName MIN2
SYMBOL pmos 4240 176 M180
WINDOW 0 56 32 Left 0
WINDOW 3 56 72 Left 0
SYMATTR InstName MPNOT4
SYMBOL nmos 4240 224 R0
WINDOW 0 56 32 Left 0
WINDOW 3 56 72 Left 0
SYMATTR InstName MNNOT4
SYMBOL nmos 4448 128 R0
WINDOW 0 56 32 Left 0
WINDOW 3 56 72 Left 0
SYMATTR InstName M3
SYMBOL nmos 4448 240 R0
WINDOW 0 56 32 Left 0
WINDOW 3 56 72 Left 0
SYMATTR InstName M4
SYMBOL cap 4528 256 R0
WINDOW 0 24 8 Left 0
WINDOW 3 24 56 Left 0
SYMATTR InstName Cint2
SYMATTR Value 0.1µ
SYMBOL pmos 3744 976 M180
WINDOW 0 56 32 Left 0
WINDOW 3 56 72 Left 0
SYMATTR InstName MW3
SYMBOL cap 3888 1040 R0
WINDOW 0 24 8 Left 0
WINDOW 3 24 56 Left 0
SYMATTR InstName Csyn3
SYMATTR Value 10n
SYMATTR SpiceLine V=4 Irms=162m Rser=0.395426 Lser=0 mfg="KEMET" pn="C0402C103K7PAC" type="X5R" IC=0
SYMBOL cap 4336 1040 R0
WINDOW 0 24 8 Left 0
WINDOW 3 24 56 Left 0
SYMATTR InstName Ck3
SYMATTR Value 10n
SYMBOL pmos 4080 976 M180
WINDOW 0 56 32 Left 0
WINDOW 3 56 72 Left 0
SYMATTR InstName MPNOT5
SYMBOL nmos 4080 1024 R0
WINDOW 0 56 32 Left 0
WINDOW 3 56 72 Left 0
SYMATTR InstName MNNOT5
SYMBOL nmos 4224 1152 R0
WINDOW 0 56 32 Left 0
WINDOW 3 56 72 Left 0
SYMATTR InstName MVREF3
SYMBOL nmos 4048 1088 M0
WINDOW 0 56 32 Left 0
WINDOW 3 56 72 Left 0
SYMATTR InstName MREF3
SYMBOL nmos 3744 1072 R0
WINDOW 0 56 32 Left 0
WINDOW 3 56 72 Left 0
SYMATTR InstName MVLK3
SYMBOL pmos 4048 928 R180
WINDOW 0 56 32 Left 0
WINDOW 3 56 72 Left 0
SYMATTR InstName MINA3
SYMBOL pmos 3744 848 M180
WINDOW 0 56 32 Left 0
WINDOW 3 56 72 Left 0
SYMATTR InstName MIN3
SYMBOL pmos 4224 976 M180
WINDOW 0 56 32 Left 0
WINDOW 3 56 72 Left 0
SYMATTR InstName MPNOT6
SYMBOL nmos 4224 1024 R0
WINDOW 0 56 32 Left 0
WINDOW 3 56 72 Left 0
SYMATTR InstName MNNOT6
SYMBOL nmos 4432 928 R0
WINDOW 0 56 32 Left 0
WINDOW 3 56 72 Left 0
SYMATTR InstName M5
SYMBOL nmos 4432 1040 R0
WINDOW 0 56 32 Left 0
WINDOW 3 56 72 Left 0
SYMATTR InstName M6
SYMBOL cap 4512 1056 R0
WINDOW 0 24 8 Left 0
WINDOW 3 24 56 Left 0
SYMATTR InstName Cint3
SYMATTR Value 0.1µ
SYMBOL pmos 3792 1680 M180
WINDOW 0 56 32 Left 0
WINDOW 3 56 72 Left 0
SYMATTR InstName MW4
SYMBOL cap 3936 1744 R0
WINDOW 0 24 8 Left 0
WINDOW 3 24 56 Left 0
SYMATTR InstName Csyn4
SYMATTR Value 10n
SYMATTR SpiceLine V=4 Irms=162m Rser=0.395426 Lser=0 mfg="KEMET" pn="C0402C103K7PAC" type="X5R" IC=0
SYMBOL cap 4384 1744 R0
WINDOW 0 24 8 Left 0
WINDOW 3 24 56 Left 0
SYMATTR InstName Ck4
SYMATTR Value 10n
SYMBOL pmos 4128 1680 M180
WINDOW 0 56 32 Left 0
WINDOW 3 56 72 Left 0
SYMATTR InstName MPNOT7
SYMBOL nmos 4128 1728 R0
WINDOW 0 56 32 Left 0
WINDOW 3 56 72 Left 0
SYMATTR InstName MNNOT7
SYMBOL nmos 4272 1856 R0
WINDOW 0 56 32 Left 0
WINDOW 3 56 72 Left 0
SYMATTR InstName MVREF4
SYMBOL nmos 4096 1792 M0
WINDOW 0 56 32 Left 0
WINDOW 3 56 72 Left 0
SYMATTR InstName MREF4
SYMBOL nmos 3792 1776 R0
WINDOW 0 56 32 Left 0
WINDOW 3 56 72 Left 0
SYMATTR InstName MVLK4
SYMBOL pmos 4096 1632 R180
WINDOW 0 56 32 Left 0
WINDOW 3 56 72 Left 0
SYMATTR InstName MINA4
SYMBOL pmos 3792 1552 M180
WINDOW 0 56 32 Left 0
WINDOW 3 56 72 Left 0
SYMATTR InstName MIN4
SYMBOL pmos 4272 1680 M180
WINDOW 0 56 32 Left 0
WINDOW 3 56 72 Left 0
SYMATTR InstName MPNOT8
SYMBOL nmos 4272 1728 R0
WINDOW 0 56 32 Left 0
WINDOW 3 56 72 Left 0
SYMATTR InstName MNNOT8
SYMBOL nmos 4480 1632 R0
WINDOW 0 56 32 Left 0
WINDOW 3 56 72 Left 0
SYMATTR InstName M7
SYMBOL nmos 4480 1744 R0
WINDOW 0 56 32 Left 0
WINDOW 3 56 72 Left 0
SYMATTR InstName M8
SYMBOL cap 4560 1760 R0
WINDOW 0 24 8 Left 0
WINDOW 3 24 56 Left 0
SYMATTR InstName Cint4
SYMATTR Value 0.1µ
SYMBOL pmos 5104 -544 M180
WINDOW 0 56 32 Left 0
WINDOW 3 56 72 Left 0
SYMATTR InstName MW5
SYMBOL cap 5248 -480 R0
WINDOW 0 24 8 Left 0
WINDOW 3 24 56 Left 0
SYMATTR InstName Csyn5
SYMATTR Value 10n
SYMATTR SpiceLine V=4 Irms=162m Rser=0.395426 Lser=0 mfg="KEMET" pn="C0402C103K7PAC" type="X5R" IC=0
SYMBOL cap 5696 -480 R0
WINDOW 0 24 8 Left 0
WINDOW 3 24 56 Left 0
SYMATTR InstName Ck5
SYMATTR Value 10n
SYMBOL pmos 5440 -544 M180
WINDOW 0 56 32 Left 0
WINDOW 3 56 72 Left 0
SYMATTR InstName MPNOT9
SYMBOL nmos 5440 -496 R0
WINDOW 0 56 32 Left 0
WINDOW 3 56 72 Left 0
SYMATTR InstName MNNOT9
SYMBOL nmos 5584 -368 R0
WINDOW 0 56 32 Left 0
WINDOW 3 56 72 Left 0
SYMATTR InstName MVREF5
SYMBOL nmos 5408 -432 M0
WINDOW 0 56 32 Left 0
WINDOW 3 56 72 Left 0
SYMATTR InstName MREF5
SYMBOL nmos 5104 -448 R0
WINDOW 0 56 32 Left 0
WINDOW 3 56 72 Left 0
SYMATTR InstName MVLK5
SYMBOL pmos 5408 -592 R180
WINDOW 0 56 32 Left 0
WINDOW 3 56 72 Left 0
SYMATTR InstName MINA5
SYMBOL pmos 5104 -672 M180
WINDOW 0 56 32 Left 0
WINDOW 3 56 72 Left 0
SYMATTR InstName MIN5
SYMBOL pmos 5584 -544 M180
WINDOW 0 56 32 Left 0
WINDOW 3 56 72 Left 0
SYMATTR InstName MPNOT10
SYMBOL nmos 5584 -496 R0
WINDOW 0 56 32 Left 0
WINDOW 3 56 72 Left 0
SYMATTR InstName MNNOT10
SYMBOL nmos 5792 -592 R0
WINDOW 0 56 32 Left 0
WINDOW 3 56 72 Left 0
SYMATTR InstName M9
SYMBOL nmos 5792 -480 R0
WINDOW 0 56 32 Left 0
WINDOW 3 56 72 Left 0
SYMATTR InstName M10
SYMBOL cap 5872 -464 R0
WINDOW 0 24 8 Left 0
WINDOW 3 24 56 Left 0
SYMATTR InstName Cint5
SYMATTR Value 0.1µ
SYMBOL pmos 5152 160 M180
WINDOW 0 56 32 Left 0
WINDOW 3 56 72 Left 0
SYMATTR InstName MW6
SYMBOL cap 5296 224 R0
WINDOW 0 24 8 Left 0
WINDOW 3 24 56 Left 0
SYMATTR InstName Csyn6
SYMATTR Value 10n
SYMATTR SpiceLine V=4 Irms=162m Rser=0.395426 Lser=0 mfg="KEMET" pn="C0402C103K7PAC" type="X5R" IC=0
SYMBOL cap 5744 224 R0
WINDOW 0 24 8 Left 0
WINDOW 3 24 56 Left 0
SYMATTR InstName Ck6
SYMATTR Value 10n
SYMBOL pmos 5488 160 M180
WINDOW 0 56 32 Left 0
WINDOW 3 56 72 Left 0
SYMATTR InstName MPNOT11
SYMBOL nmos 5488 208 R0
WINDOW 0 56 32 Left 0
WINDOW 3 56 72 Left 0
SYMATTR InstName MNNOT11
SYMBOL nmos 5632 336 R0
WINDOW 0 56 32 Left 0
WINDOW 3 56 72 Left 0
SYMATTR InstName MVREF6
SYMBOL nmos 5456 272 M0
WINDOW 0 56 32 Left 0
WINDOW 3 56 72 Left 0
SYMATTR InstName MREF6
SYMBOL nmos 5152 256 R0
WINDOW 0 56 32 Left 0
WINDOW 3 56 72 Left 0
SYMATTR InstName MVLK6
SYMBOL pmos 5456 112 R180
WINDOW 0 56 32 Left 0
WINDOW 3 56 72 Left 0
SYMATTR InstName MINA6
SYMBOL pmos 5152 32 M180
WINDOW 0 56 32 Left 0
WINDOW 3 56 72 Left 0
SYMATTR InstName MIN6
SYMBOL pmos 5632 160 M180
WINDOW 0 56 32 Left 0
WINDOW 3 56 72 Left 0
SYMATTR InstName MPNOT12
SYMBOL nmos 5632 208 R0
WINDOW 0 56 32 Left 0
WINDOW 3 56 72 Left 0
SYMATTR InstName MNNOT12
SYMBOL nmos 5840 112 R0
WINDOW 0 56 32 Left 0
WINDOW 3 56 72 Left 0
SYMATTR InstName M11
SYMBOL nmos 5840 224 R0
WINDOW 0 56 32 Left 0
WINDOW 3 56 72 Left 0
SYMATTR InstName M12
SYMBOL cap 5920 240 R0
WINDOW 0 24 8 Left 0
WINDOW 3 24 56 Left 0
SYMATTR InstName Cint6
SYMATTR Value 0.1µ
SYMBOL pmos 5136 960 M180
WINDOW 0 56 32 Left 0
WINDOW 3 56 72 Left 0
SYMATTR InstName MW7
SYMBOL cap 5280 1024 R0
WINDOW 0 24 8 Left 0
WINDOW 3 24 56 Left 0
SYMATTR InstName Csyn7
SYMATTR Value 10n
SYMATTR SpiceLine V=4 Irms=162m Rser=0.395426 Lser=0 mfg="KEMET" pn="C0402C103K7PAC" type="X5R" IC=0
SYMBOL cap 5728 1024 R0
WINDOW 0 24 8 Left 0
WINDOW 3 24 56 Left 0
SYMATTR InstName Ck7
SYMATTR Value 10n
SYMBOL pmos 5472 960 M180
WINDOW 0 56 32 Left 0
WINDOW 3 56 72 Left 0
SYMATTR InstName MPNOT13
SYMBOL nmos 5472 1008 R0
WINDOW 0 56 32 Left 0
WINDOW 3 56 72 Left 0
SYMATTR InstName MNNOT13
SYMBOL nmos 5616 1136 R0
WINDOW 0 56 32 Left 0
WINDOW 3 56 72 Left 0
SYMATTR InstName MVREF7
SYMBOL nmos 5440 1072 M0
WINDOW 0 56 32 Left 0
WINDOW 3 56 72 Left 0
SYMATTR InstName MREF7
SYMBOL nmos 5136 1056 R0
WINDOW 0 56 32 Left 0
WINDOW 3 56 72 Left 0
SYMATTR InstName MVLK7
SYMBOL pmos 5440 912 R180
WINDOW 0 56 32 Left 0
WINDOW 3 56 72 Left 0
SYMATTR InstName MINA7
SYMBOL pmos 5136 832 M180
WINDOW 0 56 32 Left 0
WINDOW 3 56 72 Left 0
SYMATTR InstName MIN7
SYMBOL pmos 5616 960 M180
WINDOW 0 56 32 Left 0
WINDOW 3 56 72 Left 0
SYMATTR InstName MPNOT14
SYMBOL nmos 5616 1008 R0
WINDOW 0 56 32 Left 0
WINDOW 3 56 72 Left 0
SYMATTR InstName MNNOT14
SYMBOL nmos 5824 912 R0
WINDOW 0 56 32 Left 0
WINDOW 3 56 72 Left 0
SYMATTR InstName M13
SYMBOL nmos 5824 1024 R0
WINDOW 0 56 32 Left 0
WINDOW 3 56 72 Left 0
SYMATTR InstName M14
SYMBOL cap 5904 1040 R0
WINDOW 0 24 8 Left 0
WINDOW 3 24 56 Left 0
SYMATTR InstName Cint7
SYMATTR Value 0.1µ
SYMBOL pmos 5184 1664 M180
WINDOW 0 56 32 Left 0
WINDOW 3 56 72 Left 0
SYMATTR InstName MW8
SYMBOL cap 5328 1728 R0
WINDOW 0 24 8 Left 0
WINDOW 3 24 56 Left 0
SYMATTR InstName Csyn8
SYMATTR Value 10n
SYMATTR SpiceLine V=4 Irms=162m Rser=0.395426 Lser=0 mfg="KEMET" pn="C0402C103K7PAC" type="X5R" IC=0
SYMBOL cap 5776 1728 R0
WINDOW 0 24 8 Left 0
WINDOW 3 24 56 Left 0
SYMATTR InstName Ck8
SYMATTR Value 10n
SYMBOL pmos 5520 1664 M180
WINDOW 0 56 32 Left 0
WINDOW 3 56 72 Left 0
SYMATTR InstName MPNOT15
SYMBOL nmos 5520 1712 R0
WINDOW 0 56 32 Left 0
WINDOW 3 56 72 Left 0
SYMATTR InstName MNNOT15
SYMBOL nmos 5664 1840 R0
WINDOW 0 56 32 Left 0
WINDOW 3 56 72 Left 0
SYMATTR InstName MVREF8
SYMBOL nmos 5488 1776 M0
WINDOW 0 56 32 Left 0
WINDOW 3 56 72 Left 0
SYMATTR InstName MREF8
SYMBOL nmos 5184 1760 R0
WINDOW 0 56 32 Left 0
WINDOW 3 56 72 Left 0
SYMATTR InstName MVLK8
SYMBOL pmos 5488 1616 R180
WINDOW 0 56 32 Left 0
WINDOW 3 56 72 Left 0
SYMATTR InstName MINA8
SYMBOL pmos 5184 1536 M180
WINDOW 0 56 32 Left 0
WINDOW 3 56 72 Left 0
SYMATTR InstName MIN8
SYMBOL pmos 5664 1664 M180
WINDOW 0 56 32 Left 0
WINDOW 3 56 72 Left 0
SYMATTR InstName MPNOT16
SYMBOL nmos 5664 1712 R0
WINDOW 0 56 32 Left 0
WINDOW 3 56 72 Left 0
SYMATTR InstName MNNOT16
SYMBOL nmos 5872 1616 R0
WINDOW 0 56 32 Left 0
WINDOW 3 56 72 Left 0
SYMATTR InstName M15
SYMBOL nmos 5872 1728 R0
WINDOW 0 56 32 Left 0
WINDOW 3 56 72 Left 0
SYMATTR InstName M16
SYMBOL cap 5952 1744 R0
WINDOW 0 24 8 Left 0
WINDOW 3 24 56 Left 0
SYMATTR InstName Cint8
SYMATTR Value 0.1µ
SYMBOL voltage 2352 880 R0
SYMATTR InstName V3
SYMATTR Value 757m
SYMBOL res 2416 864 R0
SYMATTR InstName R1
SYMATTR Value 10k
SYMBOL res 2416 1008 R0
SYMATTR InstName R2
SYMATTR Value 10k
SYMBOL res 2416 1168 R0
SYMATTR InstName R3
SYMATTR Value 10k
SYMBOL res 2416 1552 R0
SYMATTR InstName R4
SYMATTR Value 595k
SYMBOL res 2416 1344 R0
SYMATTR InstName R5
SYMATTR Value 10k
SYMBOL bv 0 288 R0
WINDOW 0 24 16 Left 0
SYMATTR InstName B1
SYMATTR Value V= 3**(TIME) -2
TEXT -96 -40 Left 2 !.tran 1
TEXT -96 -256 Left 2 !.option noopiter

The netlist it stands for:
* OZ_8_bounded_curves.asc
vtemp1 Vint 0 0.5
Vdd1 VDD 0 3.3
V1 VSS- 0 -10
V2 VSS+ 0 10
voff1 VOFFSET 0 1
voff2 VREF 0 2
voff3 vw 0 2.4
Vdd2 VGND 0 0
XU1 VGND N009 VSS+ VSS- N010 LT1001  ; pins In+ In- V+ V- OUT
R10 N010 N009 1k
R11 N009 N015 1k
XU2 VGND N011 VSS+ VSS- N012 LT1001  ; pins In+ In- V+ V- OUT
R12 N012 N011 1k
R13 N011 N010 1k
R14 N011 VOFFSET 1k
XU3 VGND N013 VSS+ VSS- N014 LT1001  ; pins In+ In- V+ V- OUT
R15 N014 N013 1.65k
R16 N013 N012 1k
XU4 VGND N016 VSS+ VSS- N017 LT1001  ; pins In+ In- V+ V- OUT
R17 N017 N016 1k
R18 N016 N015 1k
R19 N016 VOFFSET 1k
XU5 VGND N018 VSS+ VSS- N019 LT1001  ; pins In+ In- V+ V- OUT
R20 N019 N018 1.65k
R21 N018 N017 1k
XU6 N024 N015 VSS+ VSS- N015 LT1001  ; pins In+ In- V+ V- OUT
XU7 N014 VPOS VSS+ VSS- VPOS LT1001  ; pins In+ In- V+ V- OUT
XU8 N019 VNEG VSS+ VSS- VNEG LT1001  ; pins In+ In- V+ V- OUT
MW1 N006 vw N004 N004 PMOS
Csyn1 N006 0 10n V=4 Irms=162m Rser=0.395426 Lser=0 mfg="KEMET" pn="C0402C103K7PAC" type="X5R" IC=0
Ck1 SPIKES1 0 10n
MPNOT1 N002 N006 VDD VDD PMOS
MNNOT1 N002 N006 0 0 NMOS
MVREF1 N008 VREF 0 0 NMOS
MREF1 N006 SPIKES1 0 0 NMOS
MVLK1 N006 V0 0 0 NMOS
MINA1 N006 N002 VDD VDD PMOS
MIN1 N004 VPOS VDD VDD PMOS
MPNOT2 SPIKES1 N002 VDD VDD PMOS
MNNOT2 SPIKES1 N002 N008 N008 NMOS
M1 VDD SPIKES1 VOUT VOUT NMOS
M2 VOUT Vint 0 0 NMOS
Cint1 VOUT 0 0.1µ
MW2 N026 vw N023 N023 PMOS
Csyn2 N026 0 10n V=4 Irms=162m Rser=0.395426 Lser=0 mfg="KEMET" pn="C0402C103K7PAC" type="X5R" IC=0
Ck2 SPIKES2 0 10n
MPNOT3 N021 N026 VDD VDD PMOS
MNNOT3 N021 N026 0 0 NMOS
MVREF2 N028 VREF 0 0 NMOS
MREF2 N026 SPIKES2 0 0 NMOS
MVLK2 N026 V1 0 0 NMOS
MINA2 N026 N021 VDD VDD PMOS
MIN2 N023 VPOS VDD VDD PMOS
MPNOT4 SPIKES2 N021 VDD VDD PMOS
MNNOT4 SPIKES2 N021 N028 N028 NMOS
M3 VDD SPIKES2 VOUT VOUT NMOS
M4 VOUT Vint 0 0 NMOS
Cint2 VOUT 0 0.1µ
MW3 N034 vw N032 N032 PMOS
Csyn3 N034 0 10n V=4 Irms=162m Rser=0.395426 Lser=0 mfg="KEMET" pn="C0402C103K7PAC" type="X5R" IC=0
Ck3 SPIKES3 0 10n
MPNOT5 N030 N034 VDD VDD PMOS
MNNOT5 N030 N034 0 0 NMOS
MVREF3 N036 VREF 0 0 NMOS
MREF3 N034 SPIKES3 0 0 NMOS
MVLK3 N034 V2 0 0 NMOS
MINA3 N034 N030 VDD VDD PMOS
MIN3 N032 VPOS VDD VDD PMOS
MPNOT6 SPIKES3 N030 VDD VDD PMOS
MNNOT6 SPIKES3 N030 N036 N036 NMOS
M5 VDD SPIKES3 VOUT VOUT NMOS
M6 VOUT Vint 0 0 NMOS
Cint3 VOUT 0 0.1µ
MW4 N042 vw N040 N040 PMOS
Csyn4 N042 0 10n V=4 Irms=162m Rser=0.395426 Lser=0 mfg="KEMET" pn="C0402C103K7PAC" type="X5R" IC=0
Ck4 SPIKES4 0 10n
MPNOT7 N038 N042 VDD VDD PMOS
MNNOT7 N038 N042 0 0 NMOS
MVREF4 N044 VREF 0 0 NMOS
MREF4 N042 SPIKES4 0 0 NMOS
MVLK4 N042 V3 0 0 NMOS
MINA4 N042 N038 VDD VDD PMOS
MIN4 N040 VPOS VDD VDD PMOS
MPNOT8 SPIKES4 N038 VDD VDD PMOS
MNNOT8 SPIKES4 N038 N044 N044 NMOS
M7 VDD SPIKES4 VOUT VOUT NMOS
M8 VOUT Vint 0 0 NMOS
Cint4 VOUT 0 0.1µ
MW5 N005 vw N003 N003 PMOS
Csyn5 N005 0 10n V=4 Irms=162m Rser=0.395426 Lser=0 mfg="KEMET" pn="C0402C103K7PAC" type="X5R" IC=0
Ck5 SPIKES5 0 10n
MPNOT9 N001 N005 VDD VDD PMOS
MNNOT9 N001 N005 0 0 NMOS
MVREF5 N007 VREF 0 0 NMOS
MREF5 N005 SPIKES5 0 0 NMOS
MVLK5 N005 V0 0 0 NMOS
MINA5 N005 N001 VDD VDD PMOS
MIN5 N003 VNEG VDD VDD PMOS
MPNOT10 SPIKES5 N001 VDD VDD PMOS
MNNOT10 SPIKES5 N001 N007 N007 NMOS
M9 VDD SPIKES5 VOUT VOUT NMOS
M10 VOUT Vint 0 0 NMOS
Cint5 VOUT 0 0.1µ
MW6 N025 vw N022 N022 PMOS
Csyn6 N025 0 10n V=4 Irms=162m Rser=0.395426 Lser=0 mfg="KEMET" pn="C0402C103K7PAC" type="X5R" IC=0
Ck6 SPIKES6 0 10n
MPNOT11 N020 N025 VDD VDD PMOS
MNNOT11 N020 N025 0 0 NMOS
MVREF6 N027 VREF 0 0 NMOS
MREF6 N025 SPIKES6 0 0 NMOS
MVLK6 N025 V1 0 0 NMOS
MINA6 N025 N020 VDD VDD PMOS
MIN6 N022 VNEG VDD VDD PMOS
MPNOT12 SPIKES6 N020 VDD VDD PMOS
MNNOT12 SPIKES6 N020 N027 N027 NMOS
M11 VDD SPIKES6 VOUT VOUT NMOS
M12 VOUT Vint 0 0 NMOS
Cint6 VOUT 0 0.1µ
MW7 N033 vw N031 N031 PMOS
Csyn7 N033 0 10n V=4 Irms=162m Rser=0.395426 Lser=0 mfg="KEMET" pn="C0402C103K7PAC" type="X5R" IC=0
Ck7 SPIKES7 0 10n
MPNOT13 N029 N033 VDD VDD PMOS
MNNOT13 N029 N033 0 0 NMOS
MVREF7 N035 VREF 0 0 NMOS
MREF7 N033 SPIKES7 0 0 NMOS
MVLK7 N033 V2 0 0 NMOS
MINA7 N033 N029 VDD VDD PMOS
MIN7 N031 VNEG VDD VDD PMOS
MPNOT14 SPIKES7 N029 VDD VDD PMOS
MNNOT14 SPIKES7 N029 N035 N035 NMOS
M13 VDD SPIKES7 VOUT VOUT NMOS
M14 VOUT Vint 0 0 NMOS
Cint7 VOUT 0 0.1µ
MW8 N041 vw N039 N039 PMOS
Csyn8 N041 0 10n V=4 Irms=162m Rser=0.395426 Lser=0 mfg="KEMET" pn="C0402C103K7PAC" type="X5R" IC=0
Ck8 SPIKES8 0 10n
MPNOT15 N037 N041 VDD VDD PMOS
MNNOT15 N037 N041 0 0 NMOS
MVREF8 N043 VREF 0 0 NMOS
MREF8 N041 SPIKES8 0 0 NMOS
MVLK8 N041 V3 0 0 NMOS
MINA8 N041 N037 VDD VDD PMOS
MIN8 N039 VNEG VDD VDD PMOS
MPNOT16 SPIKES8 N037 VDD VDD PMOS
MNNOT16 SPIKES8 N037 N043 N043 NMOS
M15 VDD SPIKES8 VOUT VOUT NMOS
M16 VOUT Vint 0 0 NMOS
Cint8 VOUT 0 0.1µ
V3 V0 0 757m
R1 V0 V1 10k
R2 V1 V2 10k
R3 V2 V3 10k
R4 v4 0 595k
R5 V3 v4 10k
B1 N024 0 V= 3**(TIME) -2
.model NMOS NMOS
.model PMOS PMOS
.lib standard.mos
.tran 1
.option noopiter
.lib LTC.lib
.backanno
.end